# EAGLE design BMS-Shield rev3 (EAGLE 8.1.0)
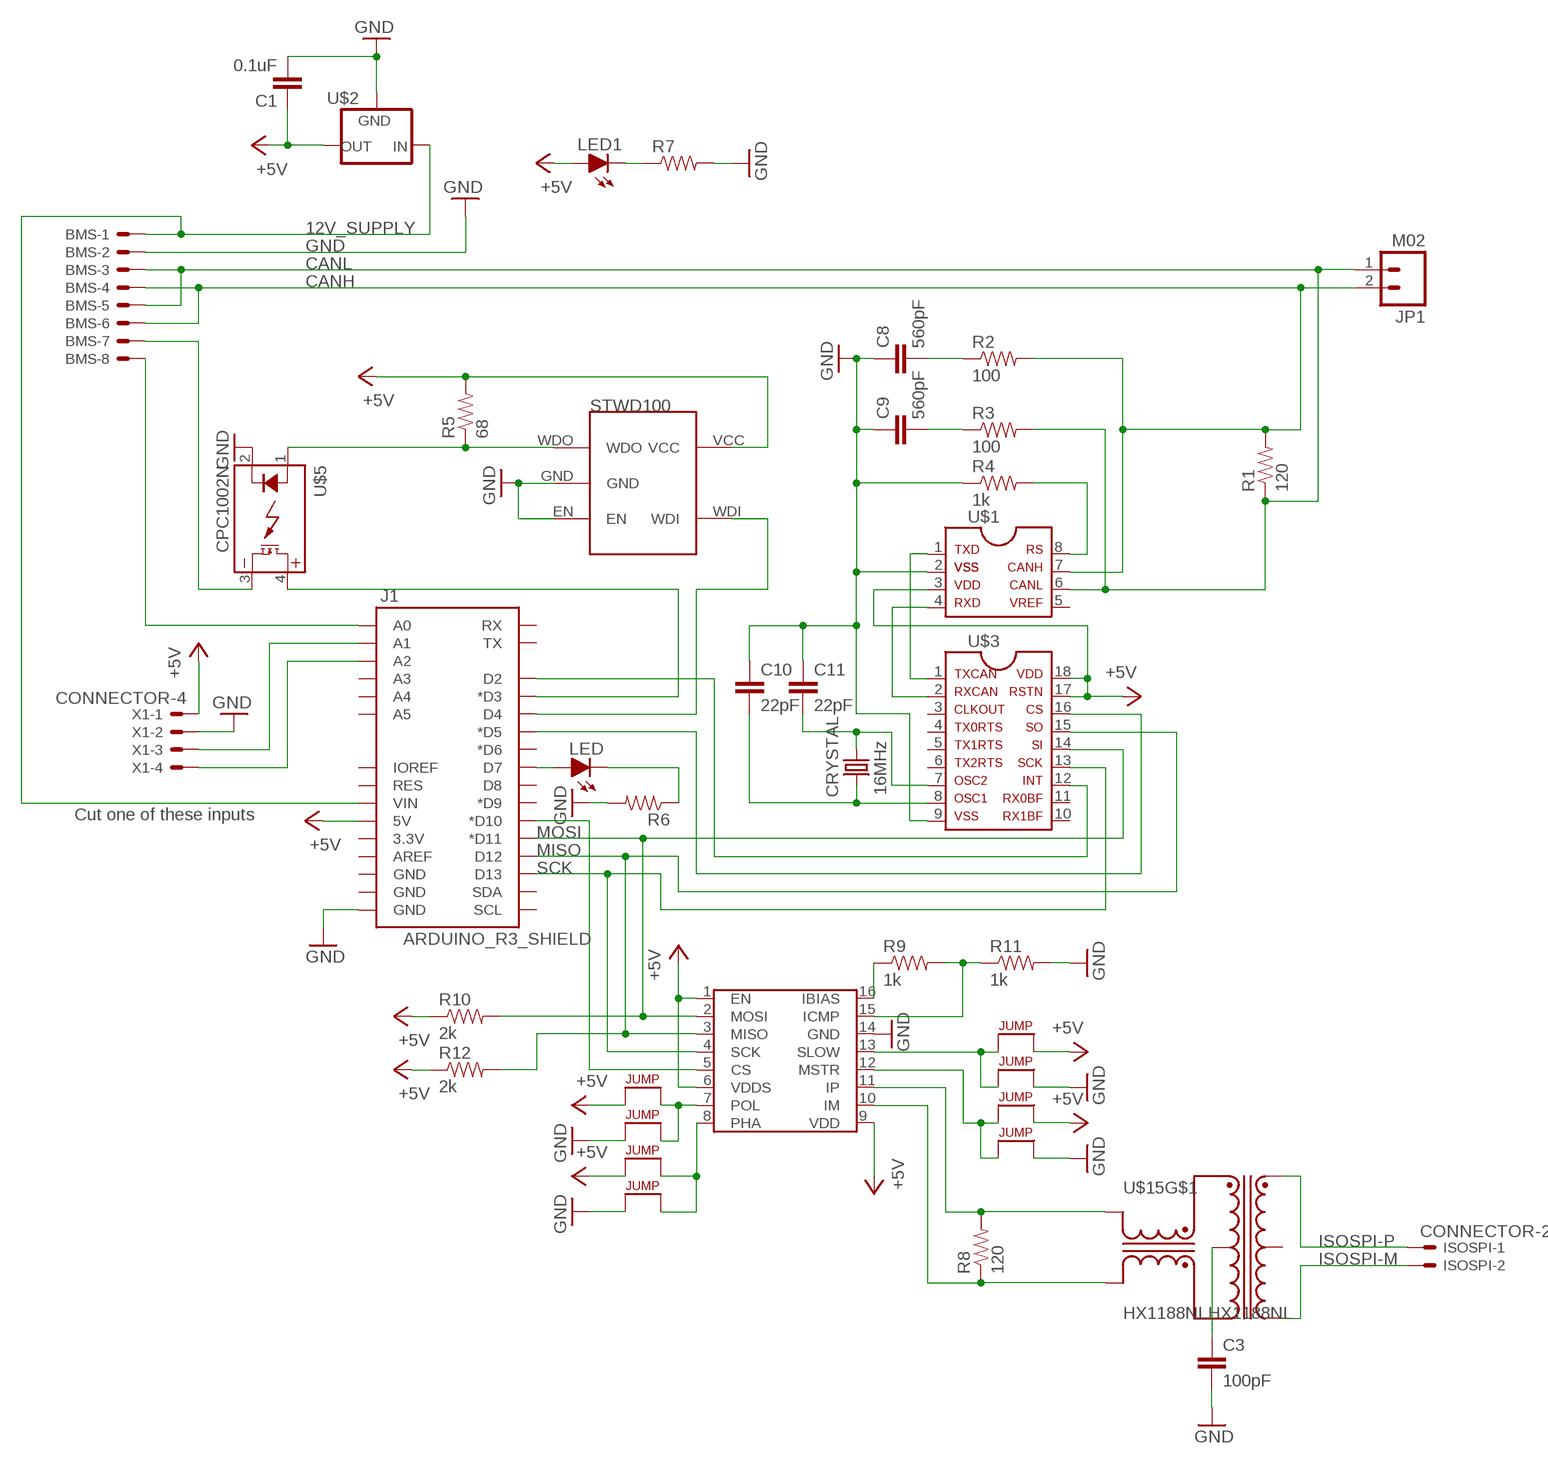
[diagram p0: schematic, sheet 1]

## Parts
BMS  MINIFIT_5566-8  [MINIFIT_5566-8]
C1  0.1uF  CAP0805  [0805]
C3  100pF  CAP0805  [0805]
C8  560pF  CAP0805  [0805]
C9  560pF  CAP0805  [0805]
C10  22pF  CAP0805  [0805]
C11  22pF  CAP0805  [0805]
CRYSTAL  16MHz  CRYSTALSMD  [HC49UP]
ISOSPI  CONNECTOR-2  [MINIFIT_5566-2]
J1  ARDUINO_R3_SHIELD  [UNO_R3_SHIELD]
JP1  M02  [1X02]
LED  LED-0805  [LED-805]
LED1  LED-0805  [LED-805]
R1  120  RESISTOR0805-RES  [0805]
R2  100  RESISTOR0805-RES  [0805]
R3  100  RESISTOR0805-RES  [0805]
R4  1k  RESISTOR0805-RES  [0805]
R5  68  RESISTOR0805-RES  [0805]
R6  RESISTOR0805-RES  [0805]
R7  RESISTOR0805-RES  [0805]
R8  120  RESISTOR0805-RES  [0805]
R9  1k  RESISTOR0805-RES  [0805]
R10  2k  RESISTOR0805-RES  [0805]
R11  1k  RESISTOR0805-RES  [0805]
R12  2k  RESISTOR0805-RES  [0805]
U$1  MCP2551  [SOIC-08]
U$2  5VREG_LM340-NLM340MPX-5.0/NOPB  [SOT223]
U$3  MCP2515SMD  [SOIC-18W]
U$4  STWD100  [SOT23-5]
U$5  CPC1002N  [SOP04]
U$6  LTC6820  [MSOP-16]
U$7  JUMPER  [0805]
U$8  JUMPER  [0805]
U$9  JUMPER  [0805]
U$10  JUMPER  [0805]
U$11  JUMPER  [0805]
U$12  JUMPER  [0805]
U$13  JUMPER  [0805]
U$14  JUMPER  [0805]
U$15  HX1188NLHX1188NL  [HX1188NL]
X1  CONNECTOR-4  [MINIFIT_5566-4]

## Nets
12V_SUPPLY: BMS.1 J1.VIN U$2.1(IN)
+5V: C1.1 J1.5V LED1.A R5.2 R10.1 R12.1 U$1.3 U$2.3(OUT) U$3.17 U$3.18 U$4.VCC U$6.1(EN) U$6.6(VDDS) U$6.9(VDD) U$7.1 U$10.1 U$11.2 U$13.2 X1.1
CANH: BMS.4 BMS.6 JP1.2 R1.2 R2.2 U$1.7
CANL: BMS.3 BMS.5 JP1.1 R1.1 R3.2 U$1.6
CS: J1.D5(*D5) U$3.16
GND: BMS.2 C1.2 C3.2 C8.1 C9.1 C10.1 C11.1 J1.GND@0(GND) R4.1 R6.2 R7.2 R11.2 U$1.2 U$2.2(GND) U$2.4(GND) U$3.9 U$4.EN U$4.GND U$5.2(CONTROL-) U$6.14(GND) U$8.1 U$9.1 U$12.2 U$14.2 X1.2
ISOSPI-M: ISOSPI.2 U$15.3(D-)
ISOSPI-P: ISOSPI.1 U$15.1(D+)
MISO: J1.D12 R12.2 U$3.15 U$6.3(MISO)
MOSI: J1.D11(*D11) R10.2 U$3.14 U$6.2(MOSI)
N$1: BMS.8 J1.A0
N$5: R5.1 U$4.WDO U$5.1(CONTROL+)
N$6: J1.D4 U$4.WDI
N$7: J1.D7 LED.A
N$8: BMS.7 U$5.3(DC-)
N$9: J1.D3(*D3) U$5.4(DC+)
N$10: J1.D2 U$3.12
N$11: C10.2 CRYSTAL.2 U$3.8
N$12: U$1.1 U$3.1
N$13: U$1.4 U$3.2
N$14: C8.2 R2.1
N$15: C11.2 CRYSTAL.1 U$3.7
N$16: R4.2 U$1.8
N$17: C9.2 R3.1
N$18: LED.C R6.1
N$19: J1.A1 X1.3
N$20: J1.A2 X1.4
N$21: J1.D10(*D10) U$6.5(CS)
N$22: LED1.C R7.1
N$23: U$6.7(POL) U$7.2 U$8.2
N$24: U$6.8(PHA) U$9.2 U$10.2
N$25: R9.1 U$6.16(IBIAS)
N$26: R9.2 R11.1 U$6.15(ICMP)
N$27: U$6.13(SLOW) U$11.1 U$12.1
N$28: U$6.12(MSTR) U$13.1 U$14.1
N$29: R8.1 U$6.10(IM) U$15.14(X-)
N$30: R8.2 U$6.11(IP) U$15.16(X+)
N$31: C3.1 U$15.15(CX)
SCK: J1.D13 U$3.13 U$6.4(SCK)
Unconnected: J1.3.3V J1.A3 J1.A4 J1.A5 J1.AREF J1.D6(*D6) J1.D8 J1.D9(*D9) J1.GND@1(GND) J1.GND@2(GND) J1.IOREF J1.RES J1.RX J1.SCL J1.SDA J1.TX U$1.5 U$3.3 U$3.4 U$3.5 U$3.6 U$3.10 U$3.11 U$15.2(CD) U$15.6(D+) U$15.7(CD) U$15.8(D-) U$15.9(X-) U$15.10(CX) U$15.11(X+)

## Notes on the sheet
- Cut one of these inputs ➡️

## Library data of the parts
BMS = HyTechDevices:MINIFIT_5566-8: Mini-Fit Junior connector 8 pole Source: http://www.molex.com; OC_FARNELL: unknown; OC_NEWARK: unknown
C1 C3 C8-C11 = HyTechDevices:CAP: Capacitor Standard 0603 ceramic capacitor, and 0.1" leaded capacitor.
CRYSTAL = SparkFun-FreqCtrl:CRYSTAL: Various standard crystals. Proven footprints.
ISOSPI = HyTechDevices:CONNECTOR-2: Mini-Fit Junior connector 2 pole Source: http://www.molex.com; OC_FARNELL: 1822072; OC_NEWARK: unknown
J1 = HyTechDevices:ARDUINO_R3_SHIELD: Shield form compatible with the Arduino Uno R3. Source: Sparkfun <https://github.com/sparkfun/SparkFun-Eagle-Libraries>
JP1 = HyTechDevices:M02: Standard 2-pin 0.1" header. NOTES ON THE VARIANTS LOCK and LOCK_LONGPADS... This footprint was designed to help hold the alignment of a through-hole component (i.e. 6-pin header) while soldering it into place. You may notice that each hole has been shifted either up or down by 0.005 of an inch from it's more standard position (which is a perfectly straight line). This slight alteration caused the pins (the squares in the middle) to touch the edges of the holes. Because they are alternating, it causes a "brace" to hold the component in place. 0.005 has proven to be the perfect amount of "off-center" position when using our standard breakaway headers. Although looks a little odd when you look at the bare footprint, once you have a header in there, the alteration is very hard to notice. Also,if you push a header all the way into place, it is covered up entirely on the bottom side. This idea of altering the position of holes to aid alignment will be further integrated into the Sparkfun Library for other footprints. It can help hold any component with 3 or more connection pins. Note: The Sparkfun version includes many other packages including surface mount that may be of future interest. Source: Sparkfun <https://github.com/sparkfun/SparkFun-Eagle-Libraries>
LED LED1 = HyTechDevices:LED: Light Emitting Diode (LED) Source: Dangerous Prototypes Eagle Library <https://github.com/DangerousPrototypes/Eagle_Part_Library>
R1-R12 = HyTechDevices:RESISTOR: Resistor Basic schematic elements and footprints for 0603, 1206, and PTH resistors.
U$1 = HyTechDevices:MCP2551: MCP2551 High-Speed CAN Transceiver Product Webpage <https://www.microchip.com/wwwproducts/en/MCP2551> Datasheet <http://ww1.microchip.com/downloads/en/DeviceDoc/21667f.pdf> This device is outdated It is replaced by MCP2561. Comparison Page <https://www.microchip.com/wwwproducts/ProductCompare/MCP2551/MCP2561> Product Webpage <https://www.microchip.com/wwwproducts/en/MCP2561> Datasheet <http://ww1.microchip.com/downloads/en/DeviceDoc/20005167C.pdf>
U$2 = HyTechDevices:5VREG_LM340-N: Voltage Regulator 5v linear voltage regulator Datasheet <http://www.mouser.com/ProductDetail/Texas-Instruments/LM340MPX-50-NOPB/?qs=X1J7HmVL2ZGZwtTFRQ9ItA%3D%3D> MAX current out: 1.5A MAX voltage in: 35V
U$3 = HyTechDevices:MCP2515: MCP2515 CAN Controller with SPI Interface Datasheet <http://ww1.microchip.com/downloads/en/DeviceDoc/21801G.pdf>
U$4 = HyTechDevices:STWD100: STWD100 Watchdog timer
U$5 = HyTechDevices:CPC1002N: IXYS Solid State Relay .7A
U$6 = HyTechDevices:LTC6820
U$7-U$14 = HyTechDevices:JUMPER: Jumper for changing operation of a device
U$15 = HyTechDevices:HX1188NL: Pulse Electronics HX1188NL Transformer
X1 = HyTechDevices:CONNECTOR-4: Mini-Fit Junior connector 4 pole Source: http://www.molex.com; OC_FARNELL: unknown; OC_NEWARK: unknown

## Board
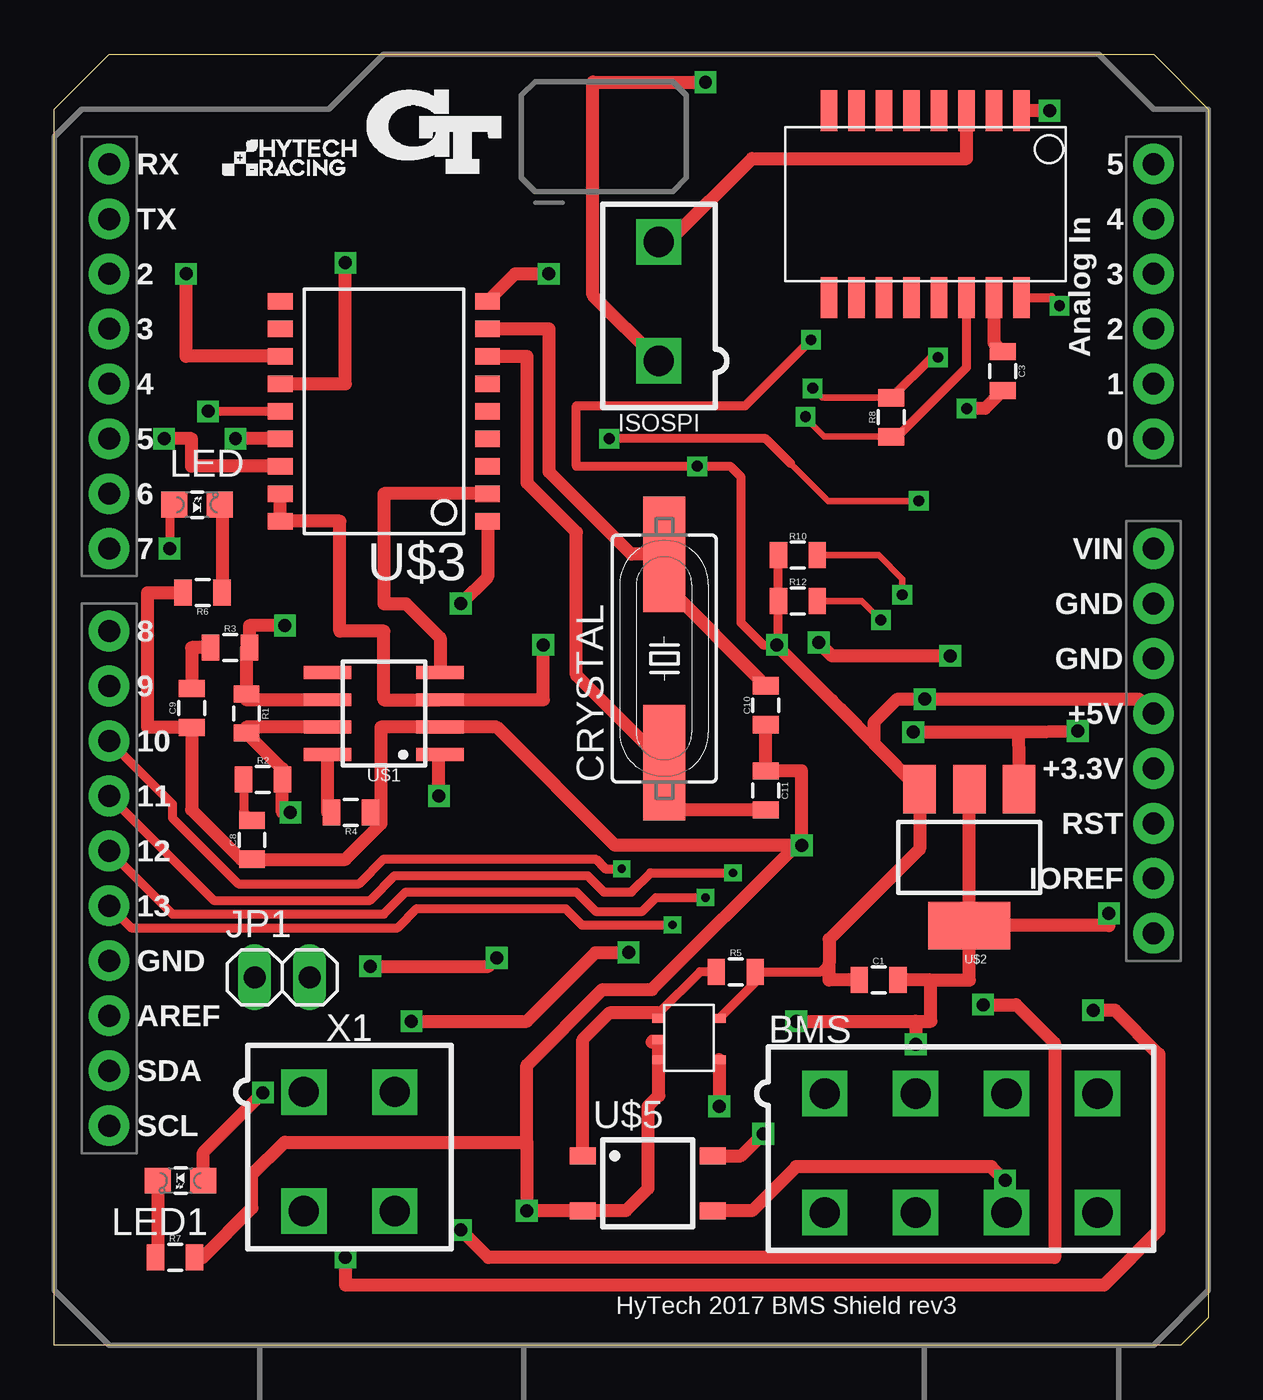
[diagram p1: board, top side]
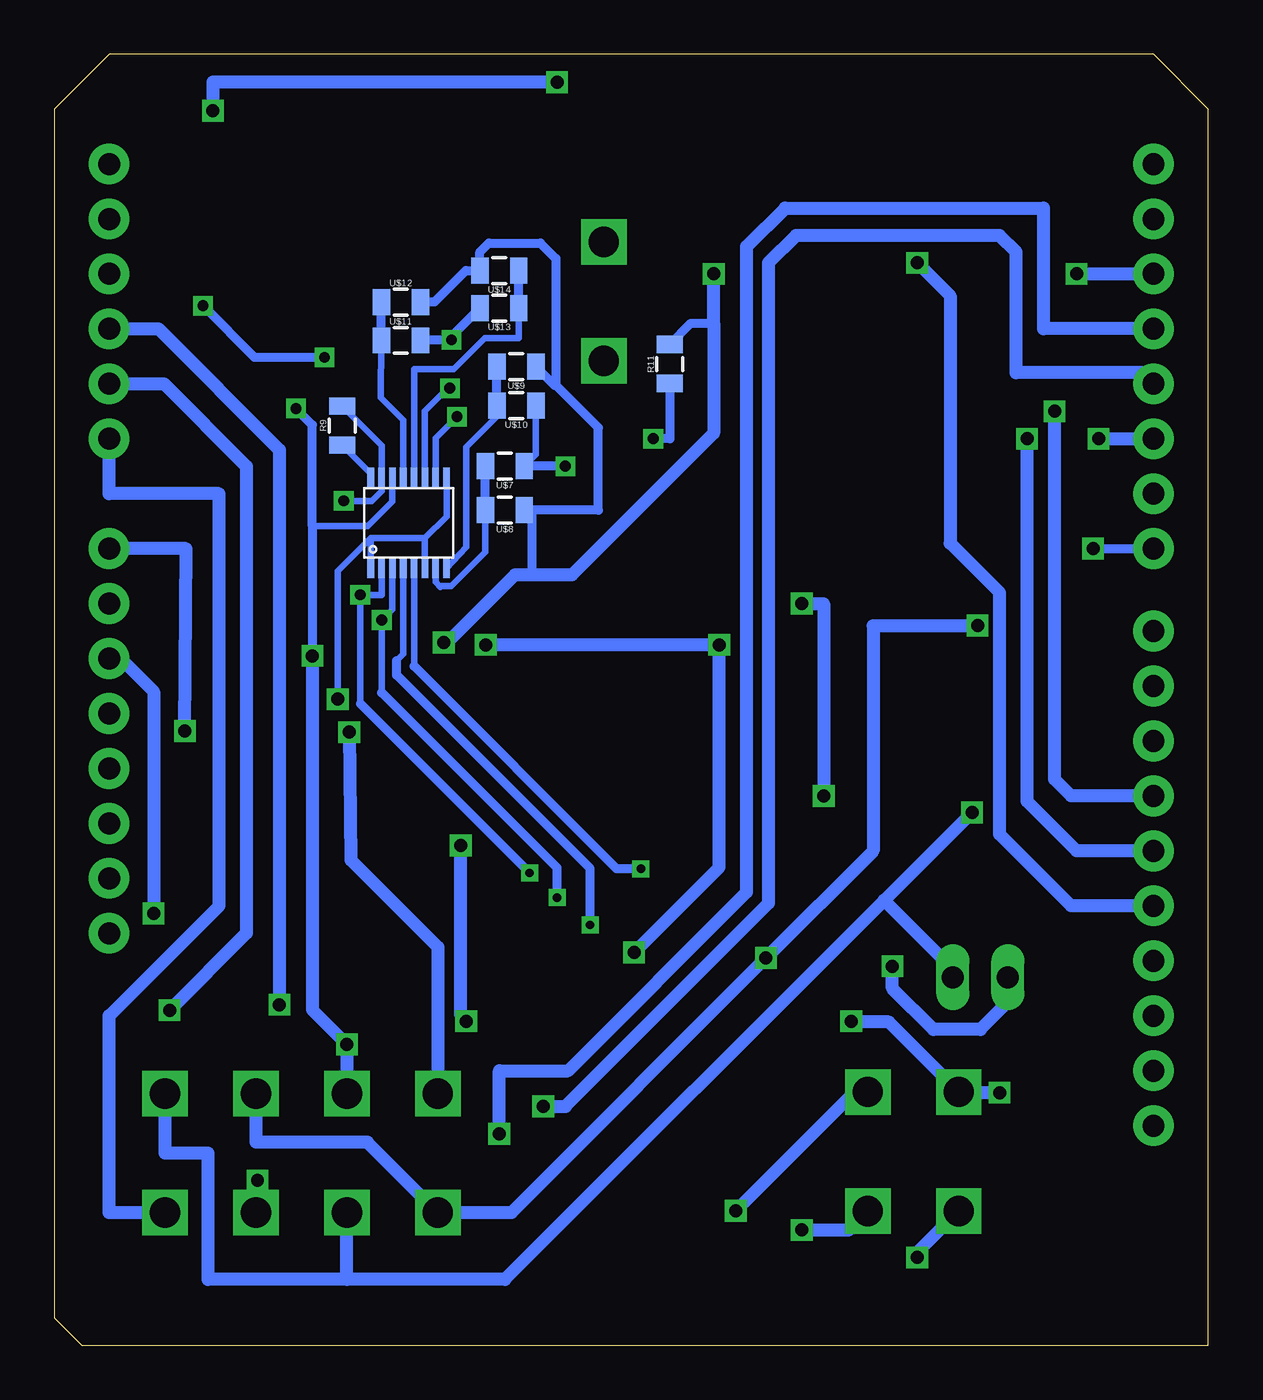
[diagram p2: board, bottom side, seen from below]

Size 53.34 x 59.69 mm. Coordinates in mm from the lower left corner, seen from the top.
Outline: 0,0 0,57.15 2.54,59.69 50.8,59.69 53.34,57.15 53.34,1.27 52.07,0 0,0
Copper layers (1*16): Top 0.035mm / dielectric 1.5mm / Bottom 0.035mm
Design rules "default *": minimum track width 10mil, minimum drill 24mil, track to track 6mil, track to pad 6mil, pad to pad 6mil, via to via 6mil, smd to smd 6mil, copper to edge 40mil, drill to drill 8mil, minimum pad ring 10mil, minimum via ring 8mil, stop-mask expansion 4mil, vias tented up to drill 0mil, thermal gap 10mil

### Footprints (pad centres in the part's own frame; a part is rotated, then mirrored left to right if it is on the bottom)
MINIFIT_5566-8 = drill 1.4 square: 1 6.3,-2.75; 2 2.1,-2.75; 3 -2.1,-2.75; 4 -6.3,-2.75; 5 6.3,2.75; 6 2.1,2.75; 7 -2.1,2.75; 8 -6.3,2.75
0805 = smd 0.8 x 1.2: 1 -0.9,0; 2 0.9,0
HC49UP = smd 5.334 x 1.93: 1 -4.826,0; 2 4.826,0
MINIFIT_5566-2 = drill 1.4 square: 1 0,-2.75; 2 0,2.75
UNO_R3_SHIELD = drill 1.016 pad 1.88: 3.3V 50.8,26.67; 5V 50.8,29.21; A0 50.8,41.91; A1 50.8,44.45; A2 50.8,46.99; A3 50.8,49.53; A4 50.8,52.07; A5 50.8,54.61; AREF 2.54,15.24; D2 2.54,49.53; D3 2.54,46.99; D4 2.54,44.45; D5 2.54,41.91; D6 2.54,39.37; D7 2.54,36.83; D8 2.54,33.02; D9 2.54,30.48; D10 2.54,27.94; D11 2.54,25.4; D12 2.54,22.86; D13 2.54,20.32; GND@0 50.8,31.75; GND@1 50.8,34.29; GND@2 2.54,17.78; IOREF 50.8,21.59; NC 50.8,19.05; RES 50.8,24.13; RX 2.54,54.61; SCL 2.54,10.16; SDA 2.54,12.7; TX 2.54,52.07; VIN 50.8,36.83
1X02 = drill 1.016 long: 1 -1.27,0; 2 1.27,0
LED-805 = smd 1.2 x 1.2: A 0,-1.05; C 0,1.05
SOIC-08 = smd 0.6 x 2.2: 1 -1.905,-2.6; 2 -0.635,-2.6; 3 0.635,-2.6; 4 1.905,-2.6; 5 1.905,2.6; 6 0.635,2.6; 7 -0.635,2.6; 8 -1.905,2.6
SOT223 = smd 1.5 x 2.235: 1 -2.3,-3.15; 2 0,-3.15; 3 2.3,-3.15 | smd 3.8 x 2.2: 4 0,3.15
SOIC-18W = smd 0.762 x 1.143: 1 -5.08,-4.788; 2 -3.81,-4.788; 3 -2.54,-4.788; 4 -1.27,-4.788; 5 0,-4.788; 6 1.27,-4.788; 7 2.54,-4.788; 8 3.81,-4.788; 9 5.08,-4.788; 10 5.08,4.788; 11 3.81,4.788; 12 2.54,4.788; 13 1.27,4.788; 14 0,4.788; 15 -1.27,4.788; 16 -2.54,4.788; 17 -3.81,4.788; 18 -5.08,4.788
SOT23-5 = smd 0.61 x 0.406: EN -2.794,0; GND -2.794,0.94; VCC 0,1.905; WDI 0,0; WDO -2.794,1.905
SOP04 = smd 0.8 x 1.2: 1 -1.27,-3; 2 1.27,-3; 3 1.27,3; 4 -1.27,3
MSOP-16 = smd 0.305 x 0.889: 1 -0.1,-0.5; 2 0.4,-0.5; 3 0.9,-0.5; 4 1.4,-0.5; 5 1.9,-0.5; 6 2.4,-0.5; 7 2.9,-0.5; 8 3.4,-0.5; 9 3.4,3.7; 10 2.9,3.7; 11 2.4,3.7; 12 1.9,3.7; 13 1.4,3.7; 14 0.9,3.7; 15 0.4,3.7; 16 -0.1,3.7
HX1188NL = smd 1.905 x 0.762: 1 -4.318,4.445; 2 -4.318,3.175; 3 -4.318,1.905; 4 -4.318,0.635; 5 -4.318,-0.635; 6 -4.318,-1.905; 7 -4.318,-3.175; 8 -4.318,-4.445; 9 4.318,-4.445; 10 4.318,-3.175; 11 4.318,-1.905; 12 4.318,-0.635; 13 4.318,0.635; 14 4.318,1.905; 15 4.318,3.175; 16 4.318,4.445
MINIFIT_5566-4 = drill 1.4 square: 1 2.1,-2.75; 2 -2.1,-2.75; 3 2.1,2.75; 4 -2.1,2.75

### Placement (x,y rotation side)
BMS  41.91,8.89 180 top
C1  38.1,16.89 0 top
C3  27pF  [0805]  43.84,45.03 270 top
C8  9.14,23.37 90 top
C9  6.35,29.46 90 top
C10  32.89,29.59 90 top
C11  32.89,25.65 270 top
CRYSTAL  28.19,31.75 90 top
ISOSPI  27.94,48.26 0 top
J1  0,0 0 top
JP1  10.54,17.02 0 top
LED  6.6,38.86 270 top
LED1  5.84,7.62 90 top
R1  8.89,29.21 270 top
R2  9.65,26.16 0 top
R3  8.13,32.26 0 top
R4  13.72,24.64 180 top
R5  31.5,17.27 0 top
R6  6.86,34.8 180 top
R7  5.59,4.06 0 top
R8  38.68,42.9 90 top
R9  40.03,42.52 90 bottom
R10  34.37,36.53 0 top
R11  24.89,45.36 90 bottom
R12  34.37,34.42 0 top
U$1  15.24,29.21 90 top
U$2  42.29,22.56 180 top
U$3  15.24,43.18 90 top
U$4  30.73,13.21 0 top
U$5  27.43,7.49 270 top
U$6  38.61,36.42 0 bottom
U$7  32.51,40.64 180 bottom
U$8  32.51,38.61 180 bottom
U$9  31.98,45.24 180 bottom
U$10  31.98,43.43 180 bottom
U$11  37.31,46.46 0 bottom
U$12  37.31,48.23 0 bottom
U$13  32.77,47.96 180 bottom
U$14  32.77,49.68 180 bottom
U$15  40.26,52.76 270 top
X1  13.64,8.97 180 top

### Tracks (layer width: path | path; a pad name or v marks a point on that pad's centre or on a via)
12V_SUPPLY  (via drill 0.6)
  Top 0.61: v39.7,28.35 44.54,28.35 | 44.54,28.35 U$2.1 | 44.54,28.35 47.24,28.4 v47.3,28.4
  Bottom 0.61: v47.3,28.4 47.24,36.83 J1.VIN | BMS.1 35.61,18.41 39.62,22.43 v39.7,28.35
+5V  (via drill 0.5, 0.6)
  Top 0.406: U$4.VCC 32.4,16.77 R5.2 35.43,17.27 35.81,17.65 | R10.1 R12.1 33.47,32.45 v33.4,32.38 32.77,32.38 31.75,33.4 31.75,40.13 31.24,40.64 v29.72,40.64 24.13,40.64 24.13,43.43 31.93,43.43 v34.98,46.48
  Top 0.61: 37.88,27.85 36.36,29.4 35.94,29.82 33.4,32.36 v33.4,32.38 | 37.88,27.85 U$2.3 39.99,22.95 35.81,18.77 35.81,17.65 35.81,16.89 C1.1 | U$3.17 U$3.18 13.21,38.1 13.21,33.02 15.24,33.02 15.24,29.84 U$1.3 22.61,29.84 v22.61,32.38 | LED1.A 6.89,8.92 v9.65,11.68 | v16.51,14.99 21.84,14.99 25.02,18.16 v26.54,18.16 | J1.5V 50.14,29.87 v40.23,29.87 38.96,29.87 37.88,28.79 37.88,27.85
  Bottom 0.305: U$6.1 38.71,36.05 38.71,37.31 | 38.71,37.31 36.21,37.31 | 36.21,37.31 U$6.6 | 36.21,37.31 35.21,38.31 U$6.9 | 38.71,37.31 40.23,35.79 v40.23,29.87 | U$7.1 31.08,41.17 U$10.1
  Bottom 0.406: v29.72,40.64 U$7.1 | 33.67,48.08 U$13.2 34.98,46.65 v34.98,46.48 36.39,46.48 U$11.2
  Bottom 0.61: v33.4,32.38 v22.61,32.38 22.61,22.1 v26.54,18.16 | v9.65,11.68 11.51,11.68 X1.1 14.77,14.95 16.47,14.95 v16.51,14.99
CANH  (via drill 0.6)
  Top 0.406: 8.89,28.57 R1.2 9.03,28.31 | v10.92,24.64 10.55,24.64
  Top 0.61: U$1.7 8.89,28.57 | 10.55,24.64 R2.2 10.55,26.65 R1.2
  Bottom 0.61: 39.81,3.05 BMS.6 | BMS.4 48.21,8.89 46.23,8.89 46.23,3.05 39.81,3.05 | 14.99,20.57 v10.92,24.64 | 14.99,20.57 32.51,3.05 39.81,3.05 | JP1.2 11.81,17.4 14.99,20.57
CANL  (via drill 0.6)
  Top 0.406: R1.1 8.89,29.84 | R3.2 8.89,32.26
  Top 0.61: U$1.6 8.89,29.84 | 8.89,32.26 R1.1 | v10.67,33.27 9.03,33.27 R3.2 | v14.61,17.53 20.07,17.53 v20.45,17.91
  Bottom 0.61: BMS.3 44.01,9.4 38.87,9.4 BMS.5 32.21,6.14 v20.45,17.91 15.49,22.86 15.49,33.27 v10.67,33.27 | JP1.1 9.27,15.88 10.54,14.61 12.7,14.61 14.61,16.51 v14.61,17.53
CS  (via drill 0.6)
  Top 0.61: U$3.16 6.35,40.64 6.35,41.91 v5.08,41.91
  Bottom 0.61: v5.08,41.91 J1.D5
GND  (via drill 0.5, 0.6)
  Top 0.406: 15.11,24.64 R4.1 | U$4.GND 27.64,14.15 27.64,14.02
  Top 0.61: U$2.4 U$2.2 | C10.1 C11.1 34.54,26.55 v34.54,23.11 34.29,23.11 | 34.29,23.11 25.91,23.11 20.45,28.57 U$1.2 15.11,28.57 15.11,24.64 15.11,24.12 13.46,22.47 C8.1 8.64,22.47 6.35,24.75 C9.1 4.32,28.56 4.32,34.8 R6.2 | 21.84,9.4 v21.84,6.22 U$5.2 26.42,6.22 27.43,7.24 27.43,11.05 27.94,11.56 U$4.EN 27.94,14.02 27.64,14.02 | 21.84,9.4 21.84,12.95 25.34,16.45 27.62,16.45 34.29,23.11 | U$3.9 21.3,49.53 v22.86,49.53 | v34.29,14.99 39.81,14.99 | R7.2 6.86,4.06 9.14,6.35 9.14,7.87 10.67,9.4 21.84,9.4 | C3.2 43.01,43.31 v42.16,43.31 | 39.04,16.89 C1.2 40.51,16.89 | 40.51,16.89 42.29,16.89 U$2.4 | 39.81,14.99 v39.81,13.92 | 39.81,14.99 40.51,14.99 40.51,16.89 | 42.52,19.41 U$2.4 | v48.74,19.96 48.74,19.41 U$2.4 | v41.4,31.88 35.94,31.88 v35.33,32.49
  Bottom 0.305: v42.16,43.31 41.67,42.81 | U$6.14 37.71,39 38.84,37.87 41.4,37.87
  Bottom 0.406: 31.24,35.62 31.24,38.61 U$8.1 28.19,38.61 28.19,42.42 30.16,44.38 | v41.4,31.88 41.4,37.87 41.4,42.55 v42.16,43.31 | R11.2 23.91,47.24 22.86,47.24 | 30.16,44.38 30.16,50.24 30.87,50.95 33.25,50.95 33.67,50.53 U$14.2 34.31,49.68 35.76,48.23 U$12.2 | U$9.1 30.22,44.38 30.16,44.38
  Bottom 0.61: BMS.2 v39.81,13.92 41.4,15.51 v41.4,31.88 | v22.86,49.53 22.86,47.24 22.86,42.16 29.4,35.62 31.24,35.62 32.04,35.62 35.18,32.49 v35.33,32.49 | v21.84,6.22 16.35,11.72 X1.2 | J1.GND@0 50.27,31.75 48.74,30.23 v48.74,19.96 | v34.29,14.99 34.54,15.24 v34.54,23.11
ISOSPI-M
  Top 0.61: ISOSPI.2 28.4,51.01 32.26,54.86 42.16,54.86 U$15.3
ISOSPI-P  (via drill 0.6)
  Top 0.61: v30.1,58.4 24.89,58.4 24.89,48.56 ISOSPI.1 | v46,57.07 U$15.1
  Bottom 0.61: v30.1,58.4 46,58.4 v46,57.07
MISO  (via drill 0.38, 0.5, 0.6)
  Top 0.305: v38.2,33.53 37.31,34.42 R12.2
  Top 0.406: J1.D12 5.46,19.94 15.24,19.94 16.26,20.95 24.13,20.95 25.02,20.07 27.18,20.07 27.81,20.7 v30.1,20.7
  Top 0.61: U$3.15 v8.38,41.91
  Bottom 0.305: U$6.3 37.71,34.02 v38.2,33.53 38.2,30.18
  Bottom 0.406: v30.1,20.7 30.1,22.07 38.2,30.18
  Bottom 0.61: v8.38,41.91 8.38,25.15 6.1,22.86 J1.D12
MOSI  (via drill 0.38, 0.5, 0.6)
  Top 0.305: v39.19,34.7 39.19,35.43 38.1,36.52 R10.2
  Top 0.406: v7.11,43.18 U$3.14 | J1.D11 7.37,20.57 14.61,20.57 15.75,21.72 24.64,21.72 25.4,20.95 26.67,20.95 27.56,21.84 v31.37,21.84
  Bottom 0.305: U$6.2 38.2,36.05 38.2,34.7 v39.19,34.7 39.19,29.67
  Bottom 0.406: 39.19,29.67 v31.37,21.84
  Bottom 0.61: v7.11,43.18 7.11,26.16 6.35,25.4 J1.D11
N$1
  Bottom 0.61: BMS.8 50.8,6.14 50.8,15.24 45.72,20.32 45.72,39.37 50.8,39.37 J1.A0
N$5
  Top 0.406: U$4.WDO 27.94,15.37 29.84,17.27 R5.1
  Top 0.61: U$5.1 24.43,14.14 25.65,15.37 27.94,15.37
N$6  (via drill 0.6)
  Top 0.61: U$4.WDI v30.73,11.05
  Bottom 0.61: J1.D4 3.05,44.96 8.89,44.96 8.89,50.55 9.65,51.31 19.05,51.31 20.32,50.04 20.32,20.45 29.72,11.05 v30.73,11.05
N$7  (via drill 0.6)
  Top 0.406: LED.A 5.33,38.86 v5.33,36.83
  Bottom 0.406: v5.33,36.83 J1.D7
N$8  (via drill 0.6)
  Top 0.61: v43.94,7.62 43.31,8.26 34.29,8.26 32.26,6.22 U$5.3
  Bottom 0.61: v43.94,7.62 44.01,7.55 BMS.7
N$9  (via drill 0.6)
  Top 0.61: U$5.4 31.75,8.76 v32.77,9.78
  Bottom 0.61: J1.D3 7.62,46.99 7.62,52.58 19.56,52.58 21.34,50.8 21.34,20.95 29.59,12.7 32.77,12.7 v32.77,9.78
N$10  (via drill 0.6)
  Top 0.61: U$3.12 6.1,45.72 v6.1,49.53
  Bottom 0.61: v6.1,49.53 J1.D2
N$11
  Top 0.61: U$3.8 22.86,46.99 22.86,40.39 26.67,36.58 CRYSTAL.2 28.19,35.19 C10.2
N$12  (via drill 0.6)
  Top 0.406: 20.07,38.1 U$3.1
  Top 0.61: v17.78,25.4 17.78,27.3 U$1.1 | U$3.1 20.03,35.52 v18.8,34.29
  Bottom 0.61: v18.8,34.29 17.78,34.29 v17.78,25.4
N$13
  Top 0.61: U$3.2 15.24,39.37 15.24,34.29 16.26,34.29 17.84,32.71 U$1.4
N$14
  Top 0.406: C8.2 8.75,24.66 R2.1
N$15
  Top 0.61: U$3.7 21.84,45.72 21.84,39.88 24.13,37.59 24.13,30.99 CRYSTAL.1 28.19,24.75 C11.2
N$16
  Top 0.406: R4.2 12.64,24.64
  Top 0.61: 12.64,24.64 U$1.8
N$17
  Top 0.406: 7.23,32.4 R3.1
  Top 0.61: R3.1 6.35,32.26 C9.2
N$18
  Top 0.406: LED.C 7.76,38.86
  Top 0.61: 7.76,38.86 R6.1
N$19  (via drill 0.6)
  Top 0.61: v13.46,4.06 13.46,2.79 48.51,2.79 51.05,5.33 51.05,13.46 49.02,15.49 v48.01,15.49
  Bottom 0.61: J1.A1 48.26,44.45 44.45,40.64 44.45,19.05 v48.01,15.49 | v13.46,4.06 13.46,4.29 X1.3
N$20  (via drill 0.6)
  Top 0.61: v42.93,15.75 44.45,15.75 46.23,13.97 46.23,4.06 20.07,4.06 v18.8,5.33
  Bottom 0.61: J1.A2 48.51,46.99 42.93,41.4 v42.93,15.75 | v18.8,5.33 16.62,5.33 X1.4
N$21  (via drill 0.38)
  Top 0.406: J1.D10 5.46,25.02 5.46,24.38 8.51,21.34 14.1,21.34 15.24,22.48 25.02,22.48 25.46,22.04 v26.23,22.04
  Bottom 0.305: 36.71,31.4 U$6.5
  Bottom 0.406: v26.23,22.04 27.34,22.04 36.71,31.4
N$22
  Top 0.61: LED1.C 4.79,4.17 R7.1
N$23
  Bottom 0.305: U$6.7 35.71,35.28 35.5,35.06 35.47,35.09 34.99,35.09 33.41,36.67 U$8.2
  Bottom 0.406: U$8.2 U$7.2
N$24
  Bottom 0.305: U$6.8 34.29,36.89 34.29,41.53 32.88,42.94 U$10.2
  Bottom 0.406: U$10.2 U$9.2
N$25
  Bottom 0.305: U$6.16 38.71,40.3 R9.1
N$26  (via drill 0.5)
  Top 0.305: 34.04,40.77 35.76,39.04 v39.95,39.04
  Top 0.406: v25.65,41.91 32.89,41.91 34.04,40.77
  Bottom 0.305: v39.95,39.04 38.66,39.04 38.21,39.49 U$6.15 38.21,41.6 R9.2
  Bottom 0.406: R11.1 24.89,41.91 v25.65,41.91
N$27
  Bottom 0.305: U$6.13 37.21,42.77 38.24,43.8 U$11.1
  Bottom 0.406: U$11.1 U$12.1
N$28
  Bottom 0.305: U$6.12 36.71,45.14 34.87,45.14 33.44,46.57 31.87,46.57 U$13.1
  Bottom 0.406: U$13.1 U$14.1
N$29  (via drill 0.5)
  Top 0.305: R8.1 35.6,42 34.72,42.88 v34.72,42.93
  Top 0.406: U$15.14 42.16,45.21 38.95,42 R8.1
  Bottom 0.305: v34.72,42.93 35.71,41.94 U$6.10
N$30  (via drill 0.5)
  Top 0.305: R8.2 35.5,43.8 v35.05,44.25
  Top 0.406: R8.2 40.55,45.67 v40.84,45.67 | U$15.16 46.08,48.44 v46.46,48.06
  Bottom 0.305: U$6.11 36.21,43.18 35.14,44.25 v35.05,44.25
  Bottom 0.406: v40.84,45.67 44.07,45.67 v46.46,48.06
N$31
  Top 0.61: C3.1 43.43,46.34 U$15.15
SCK  (via drill 0.38, 0.6)
  Top 0.406: J1.D13 3.56,19.3 15.88,19.3 16.76,20.19 23.62,20.19 24.38,19.43 v28.57,19.43
  Top 0.61: U$3.13 13.46,44.45 v13.46,50.04
  Bottom 0.305: 37.52,31.65 37.21,31.96 U$6.4
  Bottom 0.406: v28.57,19.43 28.57,22.05 37.52,30.99 37.52,31.65
  Bottom 0.61: v13.46,50.04 11.94,48.51 11.94,37.08 9.65,34.8 9.65,23.62 6.35,20.32 J1.D13

### Text on the board
tPlace: HyTech 2017 BMS Shield rev3